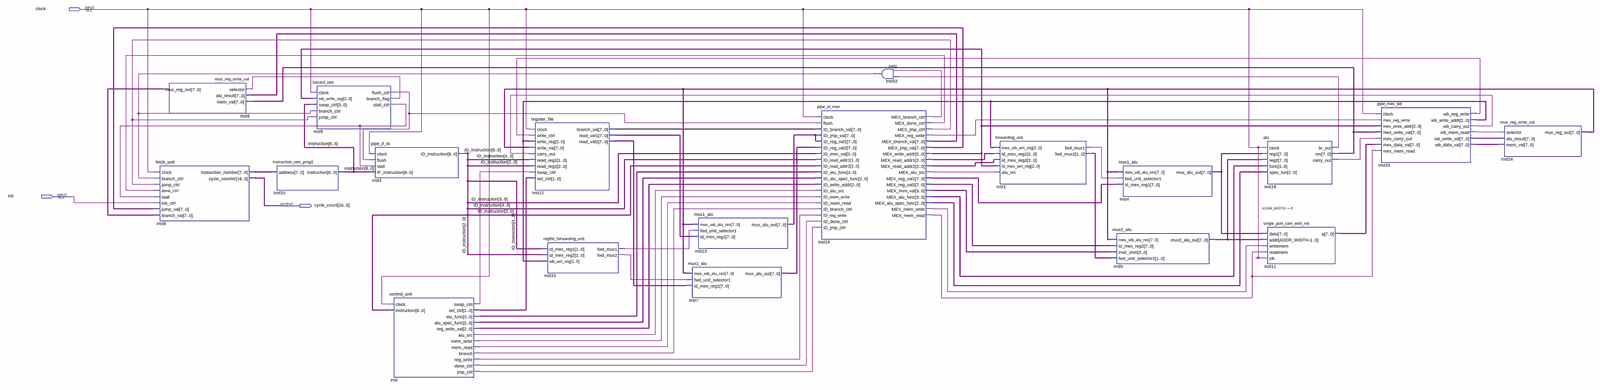
[diagram p0: schematic sheet, whole]
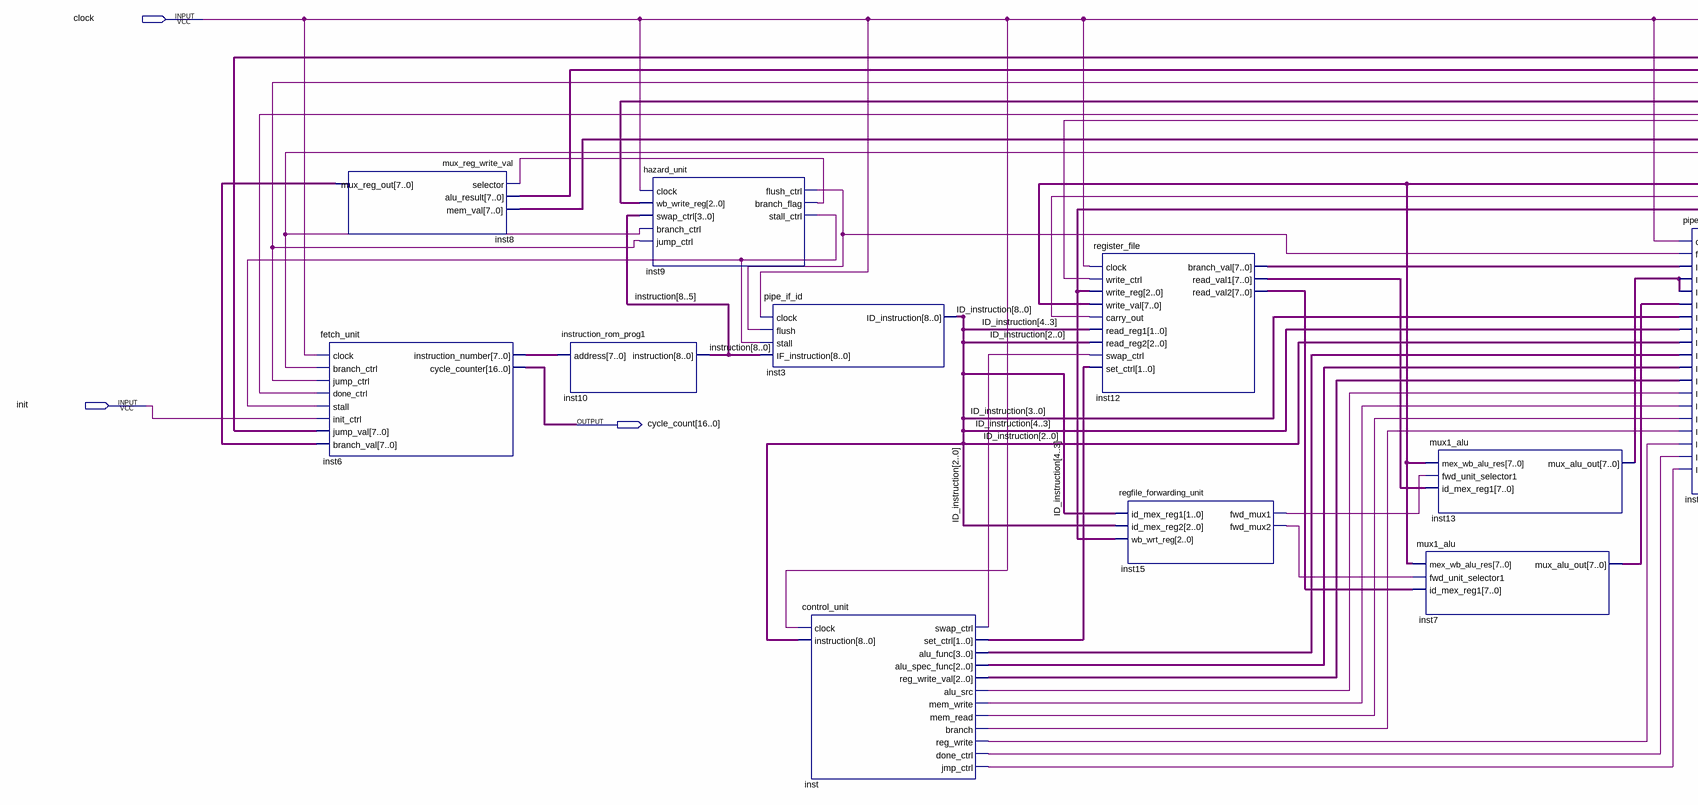
[diagram p1: schematic sheet, left part]
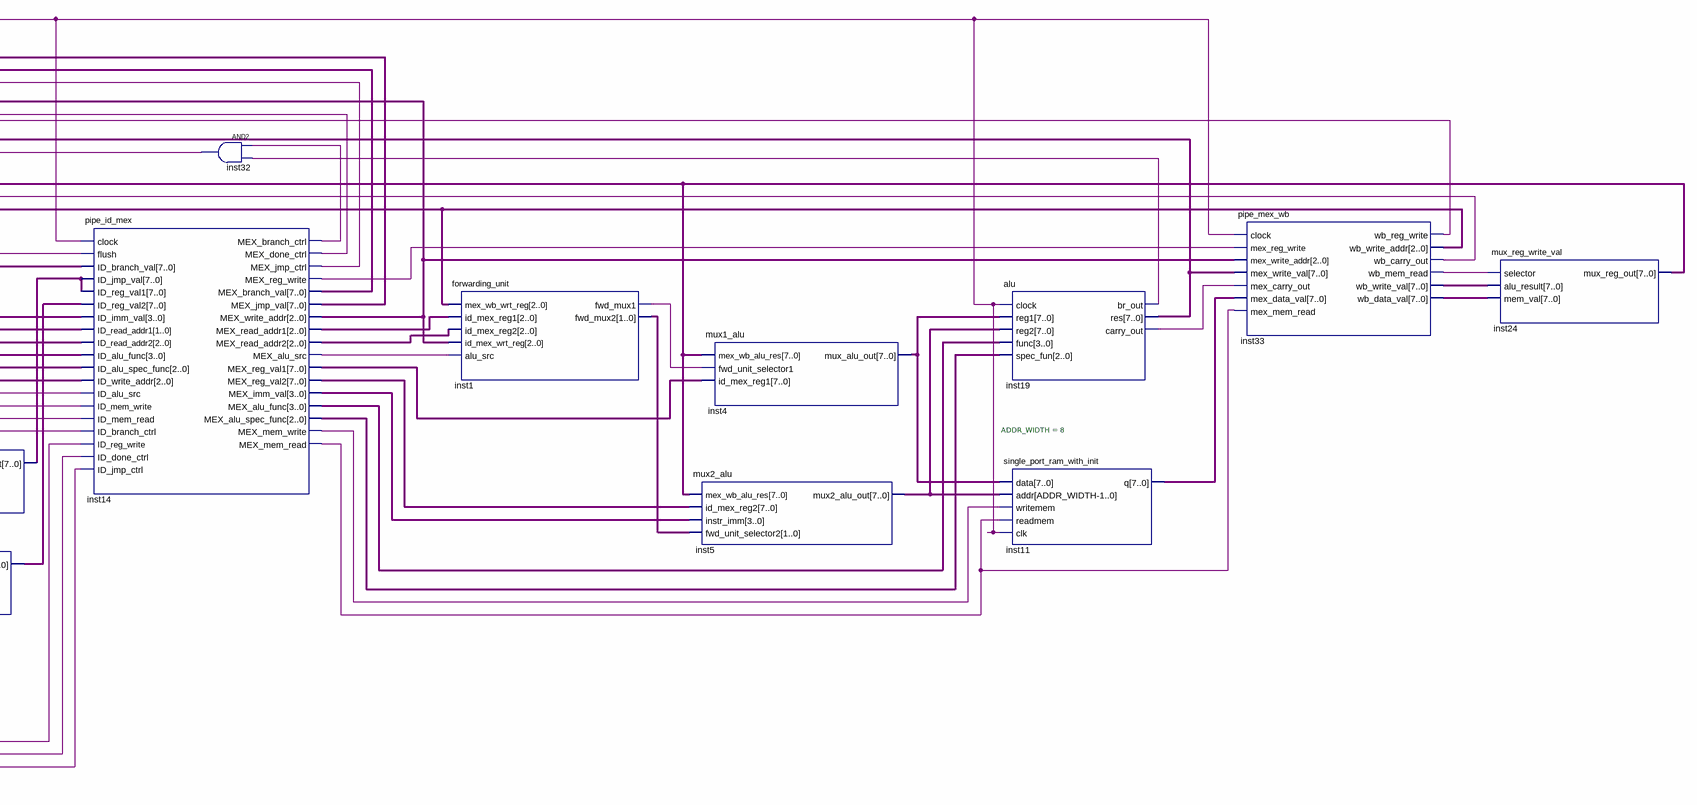
[diagram p2: schematic sheet, right part]
// Quartus schematic Lab3.bdf as structural Verilog: 19 symbols, 3 pins
module Lab3 (
  input  clock,
  input  init,
  output [16:0] cycle_count
);

  wire inst1_fwd_mux1, inst9_branch_flag, inst9_flush_ctrl, inst9_stall_ctrl, inst14_mex_alu_src,
       inst14_mex_branch_ctrl, inst14_mex_done_ctrl, inst14_mex_jmp_ctrl, inst14_mex_mem_read,
       inst14_mex_mem_write, inst14_mex_reg_write, inst15_fwd_mux1, inst15_fwd_mux2, inst19_br_out,
       inst19_carry_out, inst32_out, inst33_wb_carry_out, inst33_wb_mem_read, inst33_wb_reg_write,
       inst_alu_src, inst_branch, inst_done_ctrl, inst_jmp_ctrl, inst_mem_read, inst_mem_write,
       inst_reg_write, inst_swap_ctrl;
  wire [1:0] inst1_fwd_mux2, inst_set_ctrl;
  wire [2:0] inst14_mex_alu_spec_func, inst14_mex_read_addr1, inst14_mex_read_addr2, inst14_mex_write_addr,
       inst33_wb_write_addr, inst_alu_spec_func, inst_reg_write_val;
  wire [3:0] inst14_mex_alu_func, inst14_mex_imm_val, inst_alu_func;
  wire [7:0] inst4_mux_alu_out, inst5_mux2_alu_out, inst6_instruction_number, inst7_mux_alu_out,
       inst8_mux_reg_out, inst11_q, inst12_branch_val, inst12_read_val1, inst12_read_val2,
       inst13_mux_alu_out, inst14_mex_branch_val, inst14_mex_jmp_val, inst14_mex_reg_val1,
       inst14_mex_reg_val2, inst19_res, inst24_mux_reg_out, inst33_wb_data_val, inst33_wb_write_val;
  wire [8:0] ID_instruction, instruction;

  mux_reg_write_val inst8 (
    .selector(inst9_branch_flag), .alu_result(inst14_mex_branch_val), .mem_val(inst19_res),
    .mux_reg_out(inst8_mux_reg_out));
  fetch_unit inst6 (
    .clock(clock), .branch_ctrl(inst32_out), .jump_ctrl(inst14_mex_jmp_ctrl),
    .done_ctrl(inst14_mex_done_ctrl), .stall(inst9_stall_ctrl), .init_ctrl(init),
    .jump_val(inst14_mex_jmp_val), .branch_val(inst8_mux_reg_out),
    .instruction_number(inst6_instruction_number), .cycle_counter(cycle_count));
  instruction_rom_prog1 inst10 (.address(inst6_instruction_number), .instruction(instruction));
  hazard_unit inst9 (
    .clock(clock), .wb_write_reg(inst14_mex_write_addr), .swap_ctrl(instruction[8:5]),
    .branch_ctrl(inst32_out), .jump_ctrl(inst14_mex_jmp_ctrl), .flush_ctrl(inst9_flush_ctrl),
    .branch_flag(inst9_branch_flag), .stall_ctrl(inst9_stall_ctrl));
  pipe_if_id inst3 (
    .clock(clock), .flush(inst9_flush_ctrl), .stall(inst9_stall_ctrl), .IF_instruction(instruction),
    .ID_instruction(ID_instruction));
  control_unit inst (
    .clock(clock), .instruction(ID_instruction), .swap_ctrl(inst_swap_ctrl), .set_ctrl(inst_set_ctrl),
    .alu_func(inst_alu_func), .alu_spec_func(inst_alu_spec_func), .reg_write_val(inst_reg_write_val),
    .alu_src(inst_alu_src), .mem_write(inst_mem_write), .mem_read(inst_mem_read), .branch(inst_branch),
    .reg_write(inst_reg_write), .done_ctrl(inst_done_ctrl), .jmp_ctrl(inst_jmp_ctrl));
  register_file inst12 (
    .clock(clock), .write_ctrl(inst33_wb_reg_write), .write_reg(inst33_wb_write_addr),
    .write_val(inst24_mux_reg_out), .carry_out(inst33_wb_carry_out), .read_reg1(ID_instruction[4:3]),
    .read_reg2(ID_instruction[2:0]), .swap_ctrl(inst_swap_ctrl), .set_ctrl(inst_set_ctrl),
    .branch_val(inst12_branch_val), .read_val1(inst12_read_val1), .read_val2(inst12_read_val2));
  regfile_forwarding_unit inst15 (
    .id_mex_reg1(ID_instruction[4:3]), .id_mex_reg2(ID_instruction[2:0]), .wb_wrt_reg(inst33_wb_write_addr),
    .fwd_mux1(inst15_fwd_mux1), .fwd_mux2(inst15_fwd_mux2));
  mux1_alu inst7 (
    .mex_wb_alu_res(inst24_mux_reg_out), .fwd_unit_selector1(inst15_fwd_mux2),
    .id_mex_reg1(inst12_read_val2), .mux_alu_out(inst7_mux_alu_out));
  mux1_alu inst13 (
    .mex_wb_alu_res(inst24_mux_reg_out), .fwd_unit_selector1(inst15_fwd_mux1),
    .id_mex_reg1(inst12_read_val1), .mux_alu_out(inst13_mux_alu_out));
  pipe_id_mex inst14 (
    .clock(clock), .flush(inst9_flush_ctrl), .ID_branch_val(inst12_branch_val),
    .ID_jmp_val(inst13_mux_alu_out), .ID_reg_val1(inst13_mux_alu_out), .ID_reg_val2(inst7_mux_alu_out),
    .ID_imm_val(ID_instruction[3:0]), .ID_read_addr1(ID_instruction[4:3]),
    .ID_read_addr2(ID_instruction[2:0]), .ID_alu_func(inst_alu_func), .ID_alu_spec_func(inst_alu_spec_func),
    .ID_write_addr(inst_reg_write_val), .ID_alu_src(inst_alu_src), .ID_mem_write(inst_mem_write),
    .ID_mem_read(inst_mem_read), .ID_branch_ctrl(inst_branch), .ID_reg_write(inst_reg_write),
    .ID_done_ctrl(inst_done_ctrl), .ID_jmp_ctrl(inst_jmp_ctrl), .MEX_branch_ctrl(inst14_mex_branch_ctrl),
    .MEX_done_ctrl(inst14_mex_done_ctrl), .MEX_jmp_ctrl(inst14_mex_jmp_ctrl),
    .MEX_reg_write(inst14_mex_reg_write), .MEX_branch_val(inst14_mex_branch_val),
    .MEX_jmp_val(inst14_mex_jmp_val), .MEX_write_addr(inst14_mex_write_addr),
    .MEX_read_addr1(inst14_mex_read_addr1), .MEX_read_addr2(inst14_mex_read_addr2),
    .MEX_alu_src(inst14_mex_alu_src), .MEX_reg_val1(inst14_mex_reg_val1), .MEX_reg_val2(inst14_mex_reg_val2),
    .MEX_imm_val(inst14_mex_imm_val), .MEX_alu_func(inst14_mex_alu_func),
    .MEX_alu_spec_func(inst14_mex_alu_spec_func), .MEX_mem_write(inst14_mex_mem_write),
    .MEX_mem_read(inst14_mex_mem_read));
  and inst32 (inst32_out, inst14_mex_branch_ctrl, inst19_br_out);
  forwarding_unit inst1 (
    .mex_wb_wrt_reg(inst33_wb_write_addr), .id_mex_reg1(inst14_mex_read_addr1),
    .id_mex_reg2(inst14_mex_read_addr2), .id_mex_wrt_reg(inst14_mex_write_addr),
    .alu_src(inst14_mex_alu_src), .fwd_mux1(inst1_fwd_mux1), .fwd_mux2(inst1_fwd_mux2));
  mux1_alu inst4 (
    .mex_wb_alu_res(inst24_mux_reg_out), .fwd_unit_selector1(inst1_fwd_mux1),
    .id_mex_reg1(inst14_mex_reg_val1), .mux_alu_out(inst4_mux_alu_out));
  mux2_alu inst5 (
    .mex_wb_alu_res(inst24_mux_reg_out), .id_mex_reg2(inst14_mex_reg_val2), .instr_imm(inst14_mex_imm_val),
    .fwd_unit_selector2(inst1_fwd_mux2), .mux2_alu_out(inst5_mux2_alu_out));
  alu inst19 (
    .clock(clock), .reg1(inst4_mux_alu_out), .reg2(inst5_mux2_alu_out), .func(inst14_mex_alu_func),
    .spec_fun(inst14_mex_alu_spec_func), .br_out(inst19_br_out), .res(inst19_res),
    .carry_out(inst19_carry_out));
  single_port_ram_with_init #(.ADDR_WIDTH(8)) inst11 (
    .data(inst4_mux_alu_out), .addr(inst5_mux2_alu_out), .writemem(inst14_mex_mem_write),
    .readmem(inst14_mex_mem_read), .clk(clock), .q(inst11_q));
  pipe_mex_wb inst33 (
    .clock(clock), .mex_reg_write(inst14_mex_reg_write), .mex_write_addr(inst14_mex_write_addr),
    .mex_write_val(inst19_res), .mex_carry_out(inst19_carry_out), .mex_data_val(inst11_q),
    .mex_mem_read(inst14_mex_mem_read), .wb_reg_write(inst33_wb_reg_write),
    .wb_write_addr(inst33_wb_write_addr), .wb_carry_out(inst33_wb_carry_out),
    .wb_mem_read(inst33_wb_mem_read), .wb_write_val(inst33_wb_write_val), .wb_data_val(inst33_wb_data_val));
  mux_reg_write_val inst24 (
    .selector(inst33_wb_mem_read), .alu_result(inst33_wb_write_val), .mem_val(inst33_wb_data_val),
    .mux_reg_out(inst24_mux_reg_out));
endmodule
